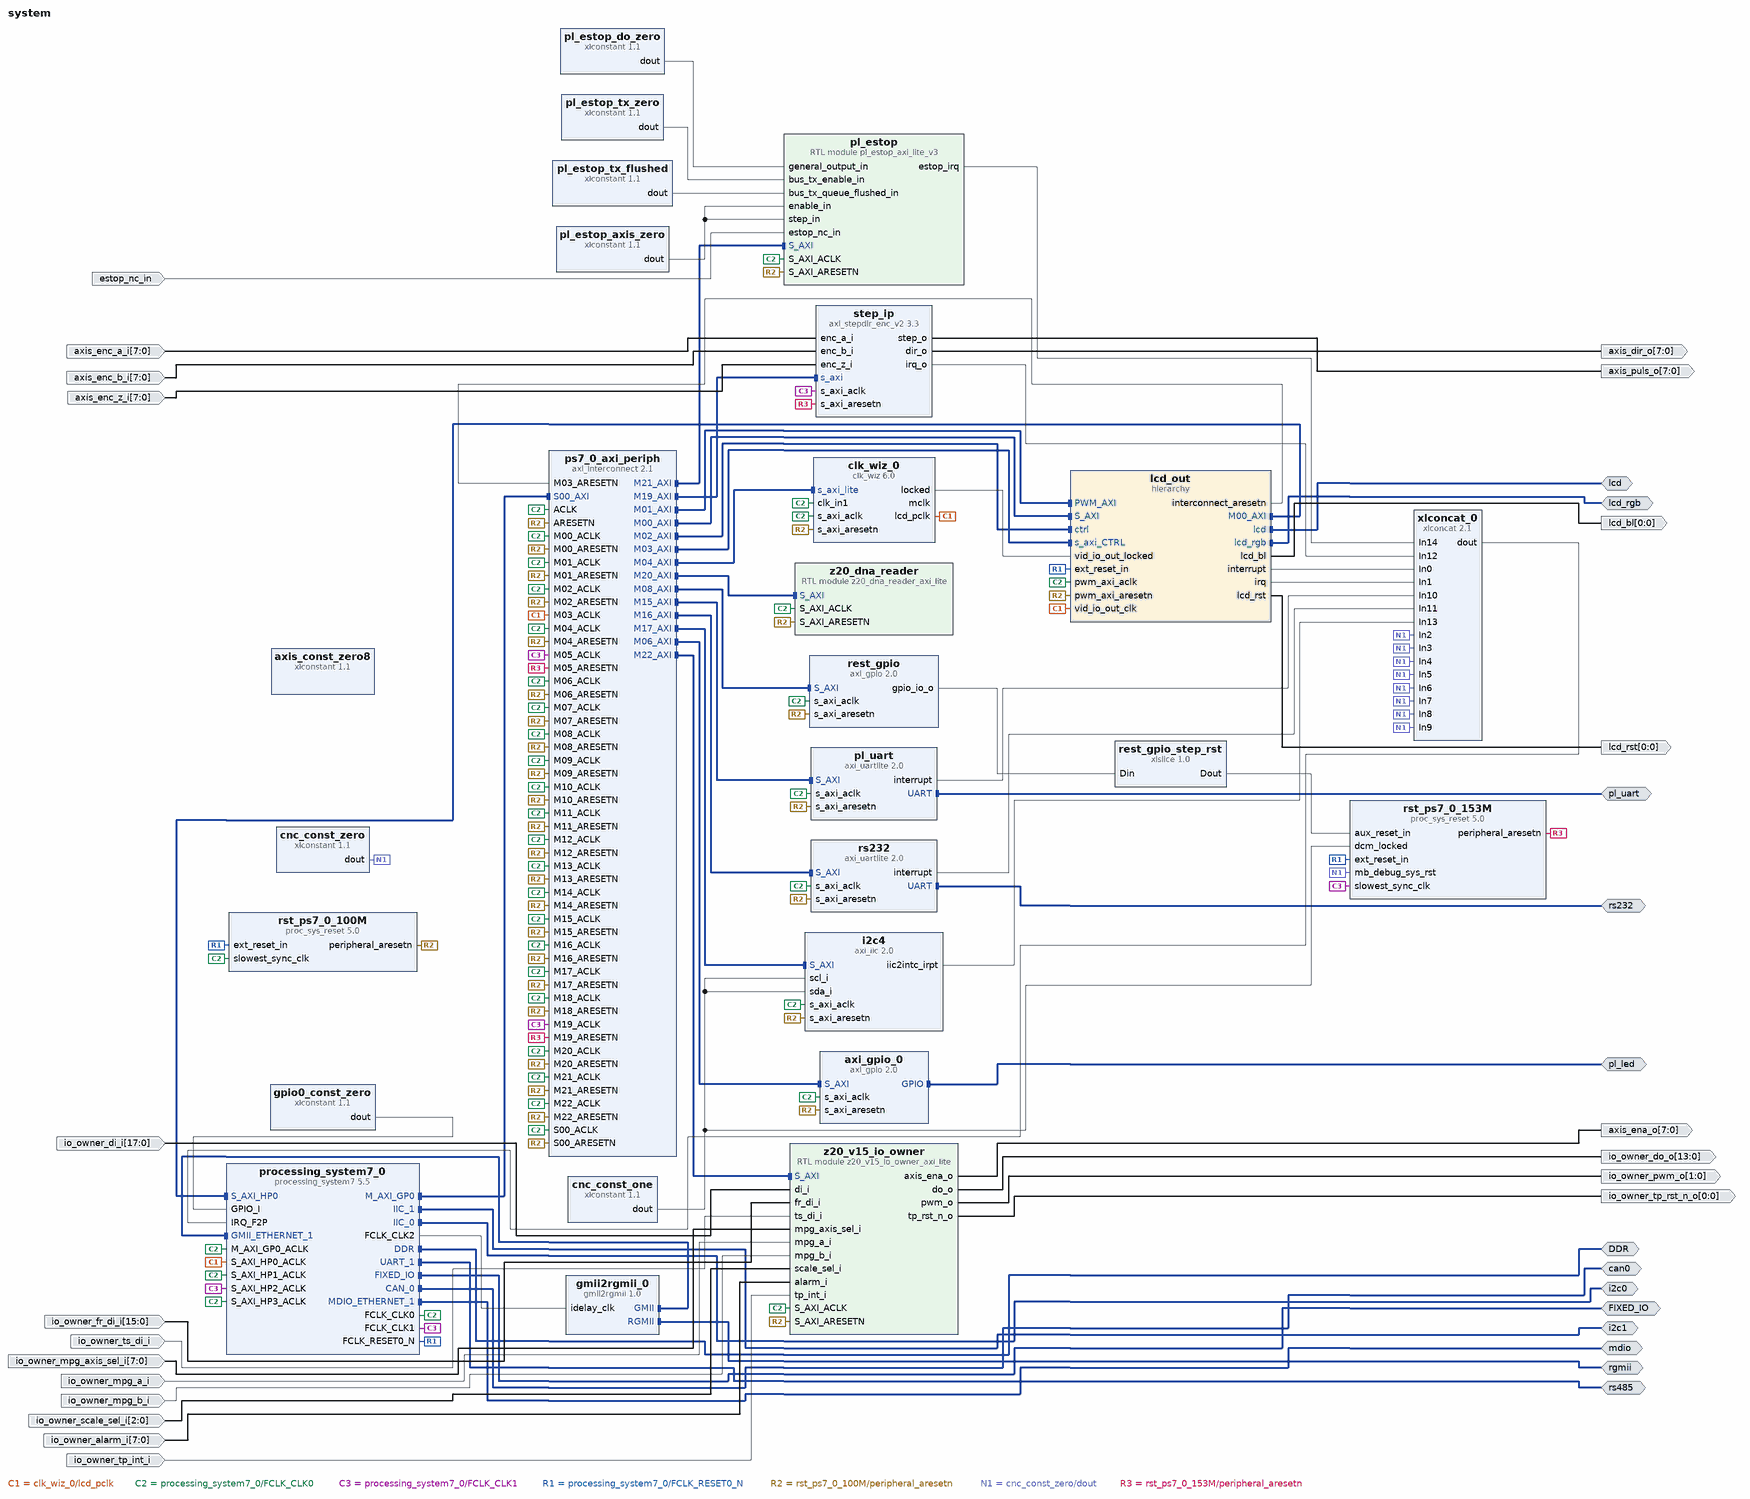
[diagram p0: block diagram of the top level]
# Vivado block design system, xc7z020clg484-2, Vivado 2020.2
create_bd_design system

create_bd_intf_port -mode Master -vlnv xilinx.com:interface:ddrx_rtl:1.0 DDR
create_bd_intf_port -mode Master -vlnv xilinx.com:display_processing_system7:fixedio_rtl:1.0 FIXED_IO
create_bd_intf_port -mode Master -vlnv xilinx.com:interface:can_rtl:1.0 can0
create_bd_intf_port -mode Master -vlnv xilinx.com:interface:iic_rtl:1.0 i2c0
create_bd_intf_port -mode Master -vlnv xilinx.com:interface:iic_rtl:1.0 i2c1
create_bd_intf_port -mode Master -vlnv xilinx.com:user:lcd_rtl:1.0 lcd
create_bd_intf_port -mode Master -vlnv xilinx.com:interface:gpio_rtl:1.0 lcd_rgb
create_bd_intf_port -mode Master -vlnv xilinx.com:interface:mdio_rtl:1.0 mdio
create_bd_intf_port -mode Master -vlnv xilinx.com:interface:gpio_rtl:1.0 pl_led
create_bd_intf_port -mode Master -vlnv xilinx.com:interface:rgmii_rtl:1.0 rgmii
create_bd_intf_port -mode Master -vlnv xilinx.com:interface:uart_rtl:1.0 rs485
create_bd_intf_port -mode Master -vlnv xilinx.com:interface:uart_rtl:1.0 pl_uart
create_bd_intf_port -mode Master -vlnv xilinx.com:interface:uart_rtl:1.0 rs232
create_bd_port -dir O -from 0 -to 0 lcd_bl
create_bd_port -dir O -from 0 -to 0 -type rst lcd_rst
create_bd_port -dir O -from 7 -to 0 axis_puls_o
create_bd_port -dir O -from 7 -to 0 axis_dir_o
create_bd_port -dir O -from 7 -to 0 axis_ena_o
create_bd_port -dir I -from 7 -to 0 axis_enc_a_i
create_bd_port -dir I -from 7 -to 0 axis_enc_b_i
create_bd_port -dir I -from 7 -to 0 axis_enc_z_i
create_bd_port -dir I estop_nc_in
create_bd_port -dir I -from 17 -to 0 io_owner_di_i
create_bd_port -dir I -from 15 -to 0 io_owner_fr_di_i
create_bd_port -dir I io_owner_ts_di_i
create_bd_port -dir I -from 7 -to 0 io_owner_mpg_axis_sel_i
create_bd_port -dir I io_owner_mpg_a_i
create_bd_port -dir I io_owner_mpg_b_i
create_bd_port -dir I -from 2 -to 0 io_owner_scale_sel_i
create_bd_port -dir I -from 7 -to 0 io_owner_alarm_i
create_bd_port -dir I io_owner_tp_int_i
create_bd_port -dir O -from 13 -to 0 io_owner_do_o
create_bd_port -dir O -from 1 -to 0 io_owner_pwm_o
create_bd_port -dir O -from 0 -to 0 io_owner_tp_rst_n_o

create_bd_cell -type hier lcd_out
create_bd_cell -type ip -vlnv xilinx.com:ip:axi_gpio:2.0 axi_gpio_0
set_property -dict {CONFIG.C_ALL_OUTPUTS 1 CONFIG.C_GPIO_WIDTH 2} [get_bd_cells axi_gpio_0]
create_bd_cell -type ip -vlnv xilinx.com:ip:clk_wiz:6.0 clk_wiz_0
set_property -dict [list \
  CONFIG.CLKOUT1_DRIVES BUFG \
  CONFIG.CLKOUT1_JITTER 159.843 \
  CONFIG.CLKOUT1_PHASE_ERROR 94.994 \
  CONFIG.CLKOUT1_REQUESTED_OUT_FREQ 33.33333 \
  CONFIG.CLKOUT2_DRIVES BUFG \
  CONFIG.CLKOUT2_JITTER 183.032 \
  CONFIG.CLKOUT2_PHASE_ERROR 94.994 \
  CONFIG.CLKOUT2_REQUESTED_OUT_FREQ 16.9344 \
  CONFIG.CLKOUT2_USED true \
  CONFIG.CLKOUT3_DRIVES BUFG \
  CONFIG.CLKOUT4_DRIVES BUFG \
  CONFIG.CLKOUT5_DRIVES BUFG \
  CONFIG.CLKOUT6_DRIVES BUFG \
  CONFIG.CLKOUT7_DRIVES BUFG \
  CONFIG.CLK_OUT1_PORT lcd_pclk \
  CONFIG.CLK_OUT2_PORT mclk \
  CONFIG.MMCM_CLKFBOUT_MULT_F 10.500 \
  CONFIG.MMCM_CLKOUT0_DIVIDE_F 31.500 \
  CONFIG.MMCM_CLKOUT1_DIVIDE 62 \
  CONFIG.MMCM_DIVCLK_DIVIDE 1 \
  CONFIG.NUM_OUT_CLKS 2 \
  CONFIG.SECONDARY_SOURCE Single_ended_clock_capable_pin \
  CONFIG.USE_DYN_RECONFIG true \
  CONFIG.USE_PHASE_ALIGNMENT false \
] [get_bd_cells clk_wiz_0]
create_bd_cell -type ip -vlnv xilinx.com:ip:processing_system7:5.5 processing_system7_0
set_property -dict [list \
  CONFIG.PCW_APU_PERIPHERAL_FREQMHZ 767.0 \
  CONFIG.PCW_CAN0_CAN0_IO EMIO \
  CONFIG.PCW_CAN0_PERIPHERAL_ENABLE 1 \
  CONFIG.PCW_CPU_CPU_6X4X_MAX_RANGE 767 \
  CONFIG.PCW_ENET0_ENET0_IO {MIO 16 .. 27} \
  CONFIG.PCW_ENET0_GRP_MDIO_ENABLE 1 \
  CONFIG.PCW_ENET0_GRP_MDIO_IO {MIO 52 .. 53} \
  CONFIG.PCW_ENET0_PERIPHERAL_ENABLE 1 \
  CONFIG.PCW_ENET1_ENET1_IO EMIO \
  CONFIG.PCW_ENET1_GRP_MDIO_ENABLE 1 \
  CONFIG.PCW_ENET1_GRP_MDIO_IO EMIO \
  CONFIG.PCW_ENET1_PERIPHERAL_ENABLE 1 \
  CONFIG.PCW_ENET_RESET_ENABLE 0 \
  CONFIG.PCW_EN_CLK1_PORT 1 \
  CONFIG.PCW_EN_CLK2_PORT 1 \
  CONFIG.PCW_EN_CLK3_PORT 1 \
  CONFIG.PCW_FCLK1_PERIPHERAL_CLKSRC {ARM PLL} \
  CONFIG.PCW_FCLK3_PERIPHERAL_CLKSRC {ARM PLL} \
  CONFIG.PCW_FCLK_CLK1_BUF TRUE \
  CONFIG.PCW_FCLK_CLK2_BUF TRUE \
  CONFIG.PCW_FCLK_CLK3_BUF TRUE \
  CONFIG.PCW_FPGA0_PERIPHERAL_FREQMHZ 100.0 \
  CONFIG.PCW_FPGA1_PERIPHERAL_FREQMHZ 150 \
  CONFIG.PCW_FPGA2_PERIPHERAL_FREQMHZ 200.0 \
  CONFIG.PCW_FPGA3_PERIPHERAL_FREQMHZ 12 \
  CONFIG.PCW_FPGA_FCLK1_ENABLE 1 \
  CONFIG.PCW_FPGA_FCLK2_ENABLE 1 \
  CONFIG.PCW_FPGA_FCLK3_ENABLE 1 \
  CONFIG.PCW_GPIO_EMIO_GPIO_ENABLE 1 \
  CONFIG.PCW_GPIO_EMIO_GPIO_IO 7 \
  CONFIG.PCW_GPIO_EMIO_GPIO_WIDTH 7 \
  CONFIG.PCW_GPIO_MIO_GPIO_ENABLE 1 \
  CONFIG.PCW_GPIO_MIO_GPIO_IO MIO \
  CONFIG.PCW_I2C0_I2C0_IO EMIO \
  CONFIG.PCW_I2C0_PERIPHERAL_ENABLE 1 \
  CONFIG.PCW_I2C1_I2C1_IO EMIO \
  CONFIG.PCW_I2C1_PERIPHERAL_ENABLE 1 \
  CONFIG.PCW_I2C_PERIPHERAL_FREQMHZ 127.777779 \
  CONFIG.PCW_I2C_RESET_ENABLE 0 \
  CONFIG.PCW_IRQ_F2P_INTR 1 \
  CONFIG.PCW_PERIPHERAL_BOARD_PRESET None \
  CONFIG.PCW_PRESET_BANK1_VOLTAGE {LVCMOS 1.8V} \
  CONFIG.PCW_QSPI_GRP_SINGLE_SS_ENABLE 1 \
  CONFIG.PCW_QSPI_GRP_SINGLE_SS_IO {MIO 1 .. 6} \
  CONFIG.PCW_QSPI_PERIPHERAL_ENABLE 1 \
  CONFIG.PCW_QSPI_QSPI_IO {MIO 1 .. 6} \
  CONFIG.PCW_SD0_GRP_CD_ENABLE 1 \
  CONFIG.PCW_SD0_GRP_CD_IO {MIO 10} \
  CONFIG.PCW_SD0_GRP_WP_ENABLE 0 \
  CONFIG.PCW_SD0_PERIPHERAL_ENABLE 1 \
  CONFIG.PCW_SD0_SD0_IO {MIO 40 .. 45} \
  CONFIG.PCW_SD1_PERIPHERAL_ENABLE 1 \
  CONFIG.PCW_SD1_SD1_IO {MIO 46 .. 51} \
  CONFIG.PCW_SDIO_PERIPHERAL_FREQMHZ 100 \
  CONFIG.PCW_SINGLE_QSPI_DATA_MODE x4 \
  CONFIG.PCW_UART0_PERIPHERAL_ENABLE 1 \
  CONFIG.PCW_UART0_UART0_IO {MIO 14 .. 15} \
  CONFIG.PCW_UART1_PERIPHERAL_ENABLE 1 \
  CONFIG.PCW_UART1_UART1_IO EMIO \
  CONFIG.PCW_UART_PERIPHERAL_FREQMHZ 100 \
  CONFIG.PCW_UIPARAM_DDR_FREQ_MHZ 533.333333 \
  CONFIG.PCW_UIPARAM_DDR_MEMORY_TYPE {DDR 3 (Low Voltage)} \
  CONFIG.PCW_UIPARAM_DDR_PARTNO {MT41K256M16 RE-125} \
  CONFIG.PCW_USB0_PERIPHERAL_ENABLE 1 \
  CONFIG.PCW_USB0_RESET_ENABLE 1 \
  CONFIG.PCW_USB0_RESET_IO {MIO 9} \
  CONFIG.PCW_USB0_USB0_IO {MIO 28 .. 39} \
  CONFIG.PCW_USB_RESET_ENABLE 1 \
  CONFIG.PCW_USB_RESET_SELECT {Share reset pin} \
  CONFIG.PCW_USE_FABRIC_INTERRUPT 1 \
  CONFIG.PCW_USE_S_AXI_HP0 1 \
  CONFIG.PCW_USE_S_AXI_HP1 1 \
  CONFIG.PCW_USE_S_AXI_HP2 1 \
  CONFIG.PCW_USE_S_AXI_HP3 1 \
  CONFIG.preset None \
] [get_bd_cells processing_system7_0]
# 523 more settings of processing_system7_0 are not shown: defaults, MIO pin electricals, DDR timing, and values the tool derives
create_bd_cell -type ip -vlnv xilinx.com:ip:axi_interconnect:2.1 ps7_0_axi_periph
set_property -dict {CONFIG.NUM_MI 23} [get_bd_cells ps7_0_axi_periph]
create_bd_cell -type ip -vlnv xilinx.com:ip:axi_gpio:2.0 rest_gpio
set_property -dict {CONFIG.C_ALL_OUTPUTS 1 CONFIG.C_GPIO_WIDTH 3} [get_bd_cells rest_gpio]
create_bd_cell -type ip -vlnv xilinx.com:ip:proc_sys_reset:5.0 rst_ps7_0_100M
create_bd_cell -type ip -vlnv xilinx.com:ip:xlconcat:2.1 xlconcat_0
set_property -dict {CONFIG.NUM_PORTS 15 CONFIG.dout_width 15} [get_bd_cells xlconcat_0]
create_bd_cell -type ip -vlnv xilinx.com:ip:axi_uartlite:2.0 pl_uart
set_property -dict {CONFIG.C_BAUDRATE 115200} [get_bd_cells pl_uart]
create_bd_cell -type ip -vlnv xilinx.com:ip:axi_uartlite:2.0 rs232
set_property -dict {CONFIG.C_BAUDRATE 9600} [get_bd_cells rs232]
create_bd_cell -type ip -vlnv xilinx.com:ip:axi_iic:2.0 i2c4
create_bd_cell -type ip -vlnv xilinx.com:ip:proc_sys_reset:5.0 rst_ps7_0_153M
create_bd_cell -type ip -vlnv xilinx.com:ip:xlconstant:1.1 cnc_const_zero
set_property -dict {CONFIG.CONST_VAL 0 CONFIG.CONST_WIDTH 1} [get_bd_cells cnc_const_zero]
create_bd_cell -type ip -vlnv xilinx.com:ip:xlconstant:1.1 cnc_const_one
set_property -dict {CONFIG.CONST_VAL 1 CONFIG.CONST_WIDTH 1} [get_bd_cells cnc_const_one]
create_bd_cell -type ip -vlnv xilinx.com:ip:xlslice:1.0 rest_gpio_step_rst
set_property -dict {CONFIG.DIN_FROM 1 CONFIG.DIN_TO 1 CONFIG.DIN_WIDTH 3} [get_bd_cells rest_gpio_step_rst]
create_bd_cell -type ip -vlnv atk:user:axi_stepdir_enc_v2:3.3 step_ip
set_property -dict {CONFIG.CLK_FREQ_HZ 153333344 CONFIG.N_AXES 8} [get_bd_cells step_ip]
create_bd_cell -type ip -vlnv xilinx.com:user:gmii2rgmii:1.0 gmii2rgmii_0
set_property -dict {CONFIG.IDELAY_VALUE 31 CONFIG.TX_CLK_FROM_RX 1} [get_bd_cells gmii2rgmii_0]
create_bd_cell -type module -reference z20_dna_reader_axi_lite z20_dna_reader
create_bd_cell -type ip -vlnv xilinx.com:ip:xlconstant:1.1 pl_estop_axis_zero
set_property -dict {CONFIG.CONST_VAL 0 CONFIG.CONST_WIDTH 8} [get_bd_cells pl_estop_axis_zero]
create_bd_cell -type ip -vlnv xilinx.com:ip:xlconstant:1.1 gpio0_const_zero
set_property -dict {CONFIG.CONST_VAL 0 CONFIG.CONST_WIDTH 7} [get_bd_cells gpio0_const_zero]
create_bd_cell -type ip -vlnv xilinx.com:ip:xlconstant:1.1 pl_estop_do_zero
set_property -dict {CONFIG.CONST_VAL 0 CONFIG.CONST_WIDTH 16} [get_bd_cells pl_estop_do_zero]
create_bd_cell -type ip -vlnv xilinx.com:ip:xlconstant:1.1 pl_estop_tx_zero
set_property -dict {CONFIG.CONST_VAL 0 CONFIG.CONST_WIDTH 1} [get_bd_cells pl_estop_tx_zero]
create_bd_cell -type ip -vlnv xilinx.com:ip:xlconstant:1.1 pl_estop_tx_flushed
set_property -dict {CONFIG.CONST_VAL 1 CONFIG.CONST_WIDTH 1} [get_bd_cells pl_estop_tx_flushed]
create_bd_cell -type ip -vlnv xilinx.com:ip:xlconstant:1.1 axis_const_zero8
set_property -dict {CONFIG.CONST_VAL 0 CONFIG.CONST_WIDTH 8} [get_bd_cells axis_const_zero8]
create_bd_cell -type module -reference pl_estop_axi_lite_v3 pl_estop
create_bd_cell -type module -reference z20_v15_io_owner_axi_lite z20_v15_io_owner

# ---- hierarchy /lcd_out ----
current_bd_instance /lcd_out
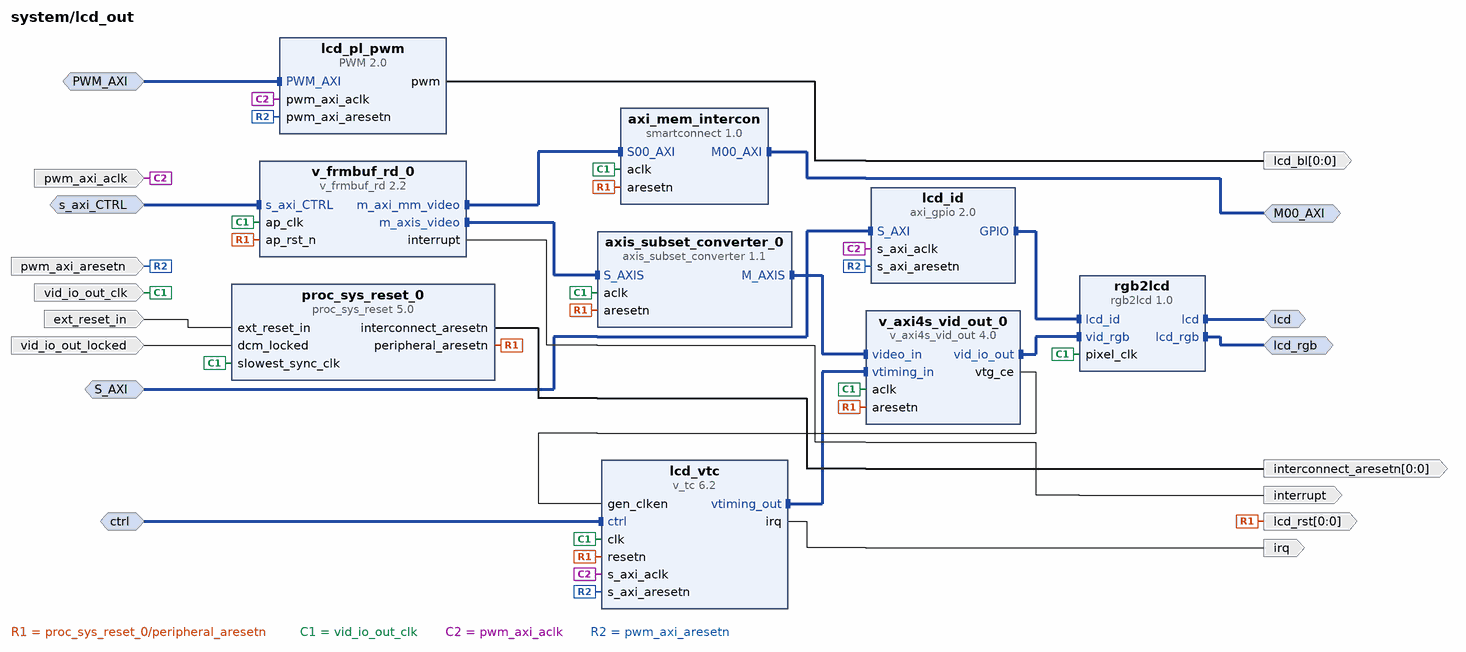
[diagram p1: block diagram inside /lcd_out]
create_bd_intf_pin -mode Master -vlnv xilinx.com:interface:aximm_rtl:1.0 M00_AXI
create_bd_intf_pin -mode Slave -vlnv xilinx.com:interface:aximm_rtl:1.0 PWM_AXI
create_bd_intf_pin -mode Slave -vlnv xilinx.com:interface:aximm_rtl:1.0 S_AXI
create_bd_intf_pin -mode Slave -vlnv xilinx.com:interface:aximm_rtl:1.0 ctrl
create_bd_intf_pin -mode Master -vlnv xilinx.com:user:lcd_rtl:1.0 lcd
create_bd_intf_pin -mode Master -vlnv xilinx.com:interface:gpio_rtl:1.0 lcd_rgb
create_bd_intf_pin -mode Slave -vlnv xilinx.com:interface:aximm_rtl:1.0 s_axi_CTRL
create_bd_pin -dir I -type rst ext_reset_in
create_bd_pin -dir O -from 0 -to 0 -type rst interconnect_aresetn
create_bd_pin -dir O -type intr interrupt
create_bd_pin -dir O -type intr irq
create_bd_pin -dir O -from 0 -to 0 lcd_bl
create_bd_pin -dir O -from 0 -to 0 -type rst lcd_rst
create_bd_pin -dir I -type clk pwm_axi_aclk
create_bd_pin -dir I -type rst pwm_axi_aresetn
create_bd_pin -dir I -type clk vid_io_out_clk
create_bd_pin -dir I vid_io_out_locked

create_bd_cell -type ip -vlnv xilinx.com:ip:axis_subset_converter:1.1 axis_subset_converter_0
set_property -dict [list \
  CONFIG.M_TDATA_NUM_BYTES 3 \
  CONFIG.S_TDATA_NUM_BYTES 3 \
  CONFIG.TDATA_REMAP {tdata[15:8],tdata[7:0],tdata[23:16]} \
  CONFIG.TDEST_REMAP {tdest[0:0]} \
  CONFIG.TID_REMAP {tid[0:0]} \
  CONFIG.TKEEP_REMAP {tkeep[2:0]} \
  CONFIG.TLAST_REMAP {tlast[0]} \
  CONFIG.TSTRB_REMAP {tstrb[2:0]} \
  CONFIG.TUSER_REMAP {tuser[0:0]} \
] [get_bd_cells axis_subset_converter_0]
create_bd_cell -type ip -vlnv xilinx.com:ip:axi_gpio:2.0 lcd_id
set_property -dict {CONFIG.C_GPIO_WIDTH 3} [get_bd_cells lcd_id]
create_bd_cell -type ip -vlnv digilentinc.com:IP:PWM:2.0 lcd_pl_pwm
create_bd_cell -type ip -vlnv xilinx.com:ip:v_tc:6.2 lcd_vtc
set_property -dict [list \
  CONFIG.enable_detection false \
  CONFIG.max_clocks_per_line 2048 \
  CONFIG.max_lines_per_frame 2048 \
] [get_bd_cells lcd_vtc]
create_bd_cell -type ip -vlnv xilinx.com:ip:proc_sys_reset:5.0 proc_sys_reset_0
create_bd_cell -type ip -vlnv www.alientek.com:user:rgb2lcd:1.0 rgb2lcd
create_bd_cell -type ip -vlnv xilinx.com:ip:v_axi4s_vid_out:4.0 v_axi4s_vid_out_0
set_property -dict {CONFIG.C_ADDR_WIDTH 10 CONFIG.C_HAS_ASYNC_CLK 0} [get_bd_cells v_axi4s_vid_out_0]
create_bd_cell -type ip -vlnv xilinx.com:ip:v_frmbuf_rd:2.2 v_frmbuf_rd_0
set_property -dict [list \
  CONFIG.AXIMM_BURST_LENGTH 2 \
  CONFIG.AXIMM_DATA_WIDTH 64 \
  CONFIG.AXIMM_NUM_OUTSTANDING 2 \
  CONFIG.C_M_AXI_MM_VIDEO_DATA_WIDTH 64 \
  CONFIG.HAS_BGR8 1 \
  CONFIG.MAX_COLS 1920 \
  CONFIG.MAX_ROWS 1080 \
  CONFIG.SAMPLES_PER_CLOCK 1 \
] [get_bd_cells v_frmbuf_rd_0]
create_bd_cell -type ip -vlnv xilinx.com:ip:smartconnect:1.0 axi_mem_intercon
set_property -dict {CONFIG.NUM_MI 1 CONFIG.NUM_SI 1} [get_bd_cells axi_mem_intercon]

# ---- connections ----

current_bd_instance /lcd_out
connect_bd_intf_net [get_bd_intf_pins rgb2lcd/vid_rgb] [get_bd_intf_pins v_axi4s_vid_out_0/vid_io_out]
connect_bd_intf_net [get_bd_intf_pins M00_AXI] [get_bd_intf_pins axi_mem_intercon/M00_AXI]
connect_bd_intf_net [get_bd_intf_pins S_AXI] [get_bd_intf_pins lcd_id/S_AXI]
connect_bd_intf_net [get_bd_intf_pins axis_subset_converter_0/M_AXIS] [get_bd_intf_pins v_axi4s_vid_out_0/video_in]
connect_bd_intf_net [get_bd_intf_pins v_frmbuf_rd_0/m_axis_video] [get_bd_intf_pins axis_subset_converter_0/S_AXIS]
connect_bd_intf_net [get_bd_intf_pins ctrl] [get_bd_intf_pins lcd_vtc/ctrl]
connect_bd_intf_net [get_bd_intf_pins axi_mem_intercon/S00_AXI] [get_bd_intf_pins v_frmbuf_rd_0/m_axi_mm_video]
connect_bd_intf_net [get_bd_intf_pins lcd_vtc/vtiming_out] [get_bd_intf_pins v_axi4s_vid_out_0/vtiming_in]
connect_bd_intf_net [get_bd_intf_pins s_axi_CTRL] [get_bd_intf_pins v_frmbuf_rd_0/s_axi_CTRL]
connect_bd_intf_net -intf_net rgb2lcd_1_lcd_rgb [get_bd_intf_pins lcd_rgb] [get_bd_intf_pins rgb2lcd/lcd_rgb]
connect_bd_intf_net [get_bd_intf_pins PWM_AXI] [get_bd_intf_pins lcd_pl_pwm/PWM_AXI]
connect_bd_intf_net -intf_net gpio1_GPIO [get_bd_intf_pins lcd_id/GPIO] [get_bd_intf_pins rgb2lcd/lcd_id]
connect_bd_intf_net -intf_net rgb2lcd_1_lcd [get_bd_intf_pins lcd] [get_bd_intf_pins rgb2lcd/lcd]
connect_bd_net -net ap_rst_n_1 [get_bd_pins proc_sys_reset_0/peripheral_aresetn] \
  [get_bd_pins lcd_rst] [get_bd_pins lcd_vtc/resetn] [get_bd_pins axis_subset_converter_0/aresetn] \
  [get_bd_pins v_axi4s_vid_out_0/aresetn] [get_bd_pins v_frmbuf_rd_0/ap_rst_n] [get_bd_pins axi_mem_intercon/aresetn]
connect_bd_net -net clk_wiz_0_clk_out1 [get_bd_pins vid_io_out_clk] \
  [get_bd_pins axis_subset_converter_0/aclk] [get_bd_pins lcd_vtc/clk] [get_bd_pins proc_sys_reset_0/slowest_sync_clk] \
  [get_bd_pins rgb2lcd/pixel_clk] [get_bd_pins v_axi4s_vid_out_0/aclk] [get_bd_pins v_frmbuf_rd_0/ap_clk] \
  [get_bd_pins axi_mem_intercon/aclk]
connect_bd_net [get_bd_pins ext_reset_in] [get_bd_pins proc_sys_reset_0/ext_reset_in]
connect_bd_net [get_bd_pins lcd_vtc/irq] [get_bd_pins irq]
connect_bd_net [get_bd_pins proc_sys_reset_0/interconnect_aresetn] [get_bd_pins interconnect_aresetn]
connect_bd_net -net processing_system7_0_FCLK_CLK0 [get_bd_pins pwm_axi_aclk] \
  [get_bd_pins lcd_id/s_axi_aclk] [get_bd_pins lcd_pl_pwm/pwm_axi_aclk] [get_bd_pins lcd_vtc/s_axi_aclk]
connect_bd_net -net pwm_0_pwm [get_bd_pins lcd_pl_pwm/pwm] [get_bd_pins lcd_bl]
connect_bd_net -net rst_ps7_0_100M_peripheral_aresetn [get_bd_pins pwm_axi_aresetn] \
  [get_bd_pins lcd_id/s_axi_aresetn] [get_bd_pins lcd_pl_pwm/pwm_axi_aresetn] [get_bd_pins lcd_vtc/s_axi_aresetn]
connect_bd_net [get_bd_pins v_axi4s_vid_out_0/vtg_ce] [get_bd_pins lcd_vtc/gen_clken]
connect_bd_net [get_bd_pins v_frmbuf_rd_0/interrupt] [get_bd_pins interrupt]
connect_bd_net -net lcd_vid_lock [get_bd_pins vid_io_out_locked] [get_bd_pins proc_sys_reset_0/dcm_locked]

current_bd_instance /
connect_bd_intf_net [get_bd_intf_ports pl_uart] [get_bd_intf_pins pl_uart/UART]
connect_bd_intf_net [get_bd_intf_pins ps7_0_axi_periph/M22_AXI] [get_bd_intf_pins z20_v15_io_owner/S_AXI]
connect_bd_intf_net [get_bd_intf_pins ps7_0_axi_periph/M20_AXI] [get_bd_intf_pins z20_dna_reader/S_AXI]
connect_bd_intf_net [get_bd_intf_ports i2c1] [get_bd_intf_pins processing_system7_0/IIC_1]
connect_bd_intf_net [get_bd_intf_ports i2c0] [get_bd_intf_pins processing_system7_0/IIC_0]
connect_bd_intf_net [get_bd_intf_ports pl_led] [get_bd_intf_pins axi_gpio_0/GPIO]
connect_bd_intf_net [get_bd_intf_pins lcd_out/PWM_AXI] [get_bd_intf_pins ps7_0_axi_periph/M01_AXI]
connect_bd_intf_net [get_bd_intf_ports DDR] [get_bd_intf_pins processing_system7_0/DDR]
connect_bd_intf_net [get_bd_intf_ports rs485] [get_bd_intf_pins processing_system7_0/UART_1]
connect_bd_intf_net -intf_net rgb2lcd_1_lcd [get_bd_intf_ports lcd] [get_bd_intf_pins lcd_out/lcd]
connect_bd_intf_net [get_bd_intf_ports FIXED_IO] [get_bd_intf_pins processing_system7_0/FIXED_IO]
connect_bd_intf_net [get_bd_intf_ports can0] [get_bd_intf_pins processing_system7_0/CAN_0]
connect_bd_intf_net [get_bd_intf_pins lcd_out/M00_AXI] [get_bd_intf_pins processing_system7_0/S_AXI_HP0]
connect_bd_intf_net [get_bd_intf_pins lcd_out/S_AXI] [get_bd_intf_pins ps7_0_axi_periph/M00_AXI]
connect_bd_intf_net [get_bd_intf_pins ps7_0_axi_periph/M08_AXI] [get_bd_intf_pins rest_gpio/S_AXI]
connect_bd_intf_net [get_bd_intf_pins processing_system7_0/M_AXI_GP0] [get_bd_intf_pins ps7_0_axi_periph/S00_AXI]
connect_bd_intf_net [get_bd_intf_pins axi_gpio_0/S_AXI] [get_bd_intf_pins ps7_0_axi_periph/M06_AXI]
connect_bd_intf_net [get_bd_intf_ports rgmii] [get_bd_intf_pins gmii2rgmii_0/RGMII]
connect_bd_intf_net [get_bd_intf_pins clk_wiz_0/s_axi_lite] [get_bd_intf_pins ps7_0_axi_periph/M04_AXI]
connect_bd_intf_net [get_bd_intf_pins lcd_out/ctrl] [get_bd_intf_pins ps7_0_axi_periph/M02_AXI]
connect_bd_intf_net [get_bd_intf_pins ps7_0_axi_periph/M21_AXI] [get_bd_intf_pins pl_estop/S_AXI]
connect_bd_intf_net [get_bd_intf_pins ps7_0_axi_periph/M16_AXI] [get_bd_intf_pins rs232/S_AXI]
connect_bd_intf_net -intf_net rgb2lcd_1_lcd_rgb [get_bd_intf_ports lcd_rgb] [get_bd_intf_pins lcd_out/lcd_rgb]
connect_bd_intf_net [get_bd_intf_pins gmii2rgmii_0/GMII] [get_bd_intf_pins processing_system7_0/GMII_ETHERNET_1]
connect_bd_intf_net [get_bd_intf_pins ps7_0_axi_periph/M19_AXI] [get_bd_intf_pins step_ip/s_axi]
connect_bd_intf_net [get_bd_intf_pins lcd_out/s_axi_CTRL] [get_bd_intf_pins ps7_0_axi_periph/M03_AXI]
connect_bd_intf_net [get_bd_intf_pins ps7_0_axi_periph/M15_AXI] [get_bd_intf_pins pl_uart/S_AXI]
connect_bd_intf_net [get_bd_intf_ports rs232] [get_bd_intf_pins rs232/UART]
connect_bd_intf_net [get_bd_intf_pins ps7_0_axi_periph/M17_AXI] [get_bd_intf_pins i2c4/S_AXI]
connect_bd_intf_net [get_bd_intf_ports mdio] [get_bd_intf_pins processing_system7_0/MDIO_ETHERNET_1]
connect_bd_net -net M03_ARESETN_1 [get_bd_pins lcd_out/interconnect_aresetn] [get_bd_pins ps7_0_axi_periph/M03_ARESETN]
connect_bd_net -net clk_wiz_0_clk_out1 [get_bd_pins clk_wiz_0/lcd_pclk] \
  [get_bd_pins lcd_out/vid_io_out_clk] [get_bd_pins processing_system7_0/S_AXI_HP0_ACLK] \
  [get_bd_pins ps7_0_axi_periph/M03_ACLK]
connect_bd_net [get_bd_pins clk_wiz_0/locked] [get_bd_pins lcd_out/vid_io_out_locked]
# net clk_wiz_0_mclk has one end: clk_wiz_0/mclk
connect_bd_net [get_bd_pins lcd_out/interrupt] [get_bd_pins xlconcat_0/In0]
connect_bd_net [get_bd_pins lcd_out/irq] [get_bd_pins xlconcat_0/In1]
connect_bd_net [get_bd_pins lcd_out/lcd_rst] [get_bd_ports lcd_rst]
connect_bd_net [get_bd_pins processing_system7_0/FCLK_CLK0] \
  [get_bd_pins lcd_out/pwm_axi_aclk] [get_bd_pins axi_gpio_0/s_axi_aclk] [get_bd_pins clk_wiz_0/s_axi_aclk] \
  [get_bd_pins clk_wiz_0/clk_in1] [get_bd_pins processing_system7_0/M_AXI_GP0_ACLK] \
  [get_bd_pins processing_system7_0/S_AXI_HP3_ACLK] [get_bd_pins ps7_0_axi_periph/ACLK] \
  [get_bd_pins ps7_0_axi_periph/S00_ACLK] [get_bd_pins ps7_0_axi_periph/M00_ACLK] [get_bd_pins ps7_0_axi_periph/M01_ACLK] \
  [get_bd_pins ps7_0_axi_periph/M02_ACLK] [get_bd_pins ps7_0_axi_periph/M04_ACLK] [get_bd_pins ps7_0_axi_periph/M06_ACLK] \
  [get_bd_pins ps7_0_axi_periph/M07_ACLK] [get_bd_pins ps7_0_axi_periph/M08_ACLK] [get_bd_pins ps7_0_axi_periph/M09_ACLK] \
  [get_bd_pins ps7_0_axi_periph/M10_ACLK] [get_bd_pins ps7_0_axi_periph/M11_ACLK] [get_bd_pins ps7_0_axi_periph/M12_ACLK] \
  [get_bd_pins ps7_0_axi_periph/M13_ACLK] [get_bd_pins rest_gpio/s_axi_aclk] [get_bd_pins rst_ps7_0_100M/slowest_sync_clk] \
  [get_bd_pins pl_uart/s_axi_aclk] [get_bd_pins ps7_0_axi_periph/M15_ACLK] [get_bd_pins rs232/s_axi_aclk] \
  [get_bd_pins ps7_0_axi_periph/M16_ACLK] [get_bd_pins ps7_0_axi_periph/M17_ACLK] [get_bd_pins i2c4/s_axi_aclk] \
  [get_bd_pins ps7_0_axi_periph/M18_ACLK] [get_bd_pins z20_dna_reader/S_AXI_ACLK] [get_bd_pins ps7_0_axi_periph/M20_ACLK] \
  [get_bd_pins ps7_0_axi_periph/M21_ACLK] [get_bd_pins ps7_0_axi_periph/M14_ACLK] \
  [get_bd_pins processing_system7_0/S_AXI_HP1_ACLK] [get_bd_pins pl_estop/S_AXI_ACLK] \
  [get_bd_pins z20_v15_io_owner/S_AXI_ACLK] [get_bd_pins ps7_0_axi_periph/M22_ACLK]
connect_bd_net [get_bd_pins processing_system7_0/FCLK_CLK1] \
  [get_bd_pins processing_system7_0/S_AXI_HP2_ACLK] [get_bd_pins ps7_0_axi_periph/M05_ACLK] \
  [get_bd_pins ps7_0_axi_periph/M19_ACLK] [get_bd_pins rst_ps7_0_153M/slowest_sync_clk] [get_bd_pins step_ip/s_axi_aclk]
connect_bd_net [get_bd_pins processing_system7_0/FCLK_CLK2] [get_bd_pins gmii2rgmii_0/idelay_clk]
connect_bd_net [get_bd_pins processing_system7_0/FCLK_RESET0_N] \
  [get_bd_pins lcd_out/ext_reset_in] [get_bd_pins rst_ps7_0_100M/ext_reset_in] [get_bd_pins rst_ps7_0_153M/ext_reset_in]
connect_bd_net -net pwm_0_pwm [get_bd_pins lcd_out/lcd_bl] [get_bd_ports lcd_bl]
connect_bd_net [get_bd_pins rest_gpio/gpio_io_o] [get_bd_pins rest_gpio_step_rst/Din]
connect_bd_net [get_bd_pins rst_ps7_0_100M/peripheral_aresetn] \
  [get_bd_pins lcd_out/pwm_axi_aresetn] [get_bd_pins axi_gpio_0/s_axi_aresetn] [get_bd_pins clk_wiz_0/s_axi_aresetn] \
  [get_bd_pins ps7_0_axi_periph/ARESETN] [get_bd_pins ps7_0_axi_periph/S00_ARESETN] \
  [get_bd_pins ps7_0_axi_periph/M00_ARESETN] [get_bd_pins ps7_0_axi_periph/M01_ARESETN] \
  [get_bd_pins ps7_0_axi_periph/M02_ARESETN] [get_bd_pins ps7_0_axi_periph/M04_ARESETN] \
  [get_bd_pins ps7_0_axi_periph/M06_ARESETN] [get_bd_pins ps7_0_axi_periph/M07_ARESETN] \
  [get_bd_pins ps7_0_axi_periph/M08_ARESETN] [get_bd_pins ps7_0_axi_periph/M09_ARESETN] \
  [get_bd_pins ps7_0_axi_periph/M10_ARESETN] [get_bd_pins ps7_0_axi_periph/M11_ARESETN] \
  [get_bd_pins ps7_0_axi_periph/M12_ARESETN] [get_bd_pins ps7_0_axi_periph/M13_ARESETN] [get_bd_pins rest_gpio/s_axi_aresetn] \
  [get_bd_pins pl_uart/s_axi_aresetn] [get_bd_pins ps7_0_axi_periph/M15_ARESETN] [get_bd_pins rs232/s_axi_aresetn] \
  [get_bd_pins ps7_0_axi_periph/M16_ARESETN] [get_bd_pins ps7_0_axi_periph/M17_ARESETN] [get_bd_pins i2c4/s_axi_aresetn] \
  [get_bd_pins ps7_0_axi_periph/M18_ARESETN] [get_bd_pins z20_dna_reader/S_AXI_ARESETN] \
  [get_bd_pins ps7_0_axi_periph/M20_ARESETN] [get_bd_pins ps7_0_axi_periph/M21_ARESETN] \
  [get_bd_pins ps7_0_axi_periph/M14_ARESETN] [get_bd_pins pl_estop/S_AXI_ARESETN] \
  [get_bd_pins z20_v15_io_owner/S_AXI_ARESETN] [get_bd_pins ps7_0_axi_periph/M22_ARESETN]
connect_bd_net [get_bd_pins xlconcat_0/dout] [get_bd_pins processing_system7_0/IRQ_F2P]
connect_bd_net [get_bd_pins pl_uart/interrupt] [get_bd_pins xlconcat_0/In10]
connect_bd_net [get_bd_pins rs232/interrupt] [get_bd_pins xlconcat_0/In11]
connect_bd_net [get_bd_pins i2c4/iic2intc_irpt] [get_bd_pins xlconcat_0/In13]
connect_bd_net [get_bd_pins step_ip/irq_o] [get_bd_pins xlconcat_0/In12]
connect_bd_net [get_bd_pins cnc_const_one/dout] [get_bd_pins rst_ps7_0_153M/dcm_locked] [get_bd_pins i2c4/scl_i] [get_bd_pins i2c4/sda_i]
connect_bd_net [get_bd_pins cnc_const_zero/dout] \
  [get_bd_pins rst_ps7_0_153M/mb_debug_sys_rst] [get_bd_pins xlconcat_0/In2] [get_bd_pins xlconcat_0/In3] \
  [get_bd_pins xlconcat_0/In4] [get_bd_pins xlconcat_0/In5] [get_bd_pins xlconcat_0/In6] [get_bd_pins xlconcat_0/In7] \
  [get_bd_pins xlconcat_0/In8] [get_bd_pins xlconcat_0/In9]
connect_bd_net [get_bd_pins rst_ps7_0_153M/peripheral_aresetn] \
  [get_bd_pins ps7_0_axi_periph/M05_ARESETN] [get_bd_pins ps7_0_axi_periph/M19_ARESETN] [get_bd_pins step_ip/s_axi_aresetn]
connect_bd_net [get_bd_pins rest_gpio_step_rst/Dout] [get_bd_pins rst_ps7_0_153M/aux_reset_in]
connect_bd_net [get_bd_pins gpio0_const_zero/dout] [get_bd_pins processing_system7_0/GPIO_I]
connect_bd_net -net pl_estop_general_output_zero_dout [get_bd_pins pl_estop_do_zero/dout] [get_bd_pins pl_estop/general_output_in]
connect_bd_net [get_bd_pins pl_estop_tx_zero/dout] [get_bd_pins pl_estop/bus_tx_enable_in]
connect_bd_net [get_bd_pins pl_estop_tx_flushed/dout] [get_bd_pins pl_estop/bus_tx_queue_flushed_in]
connect_bd_net [get_bd_pins pl_estop/estop_irq] [get_bd_pins xlconcat_0/In14]
connect_bd_net [get_bd_pins step_ip/step_o] [get_bd_ports axis_puls_o]
connect_bd_net [get_bd_pins step_ip/dir_o] [get_bd_ports axis_dir_o]
connect_bd_net [get_bd_ports axis_enc_a_i] [get_bd_pins step_ip/enc_a_i]
connect_bd_net [get_bd_ports axis_enc_b_i] [get_bd_pins step_ip/enc_b_i]
connect_bd_net [get_bd_ports axis_enc_z_i] [get_bd_pins step_ip/enc_z_i]
connect_bd_net [get_bd_pins pl_estop_axis_zero/dout] [get_bd_pins pl_estop/step_in] [get_bd_pins pl_estop/enable_in]
connect_bd_net [get_bd_ports estop_nc_in] [get_bd_pins pl_estop/estop_nc_in]
connect_bd_net [get_bd_ports io_owner_di_i] [get_bd_pins z20_v15_io_owner/di_i]
connect_bd_net [get_bd_ports io_owner_fr_di_i] [get_bd_pins z20_v15_io_owner/fr_di_i]
connect_bd_net [get_bd_ports io_owner_ts_di_i] [get_bd_pins z20_v15_io_owner/ts_di_i]
connect_bd_net [get_bd_ports io_owner_mpg_axis_sel_i] [get_bd_pins z20_v15_io_owner/mpg_axis_sel_i]
connect_bd_net [get_bd_ports io_owner_mpg_a_i] [get_bd_pins z20_v15_io_owner/mpg_a_i]
connect_bd_net [get_bd_ports io_owner_mpg_b_i] [get_bd_pins z20_v15_io_owner/mpg_b_i]
connect_bd_net [get_bd_ports io_owner_scale_sel_i] [get_bd_pins z20_v15_io_owner/scale_sel_i]
connect_bd_net [get_bd_ports io_owner_alarm_i] [get_bd_pins z20_v15_io_owner/alarm_i]
connect_bd_net [get_bd_ports io_owner_tp_int_i] [get_bd_pins z20_v15_io_owner/tp_int_i]
connect_bd_net [get_bd_pins z20_v15_io_owner/do_o] [get_bd_ports io_owner_do_o]
connect_bd_net [get_bd_pins z20_v15_io_owner/pwm_o] [get_bd_ports io_owner_pwm_o]
connect_bd_net [get_bd_pins z20_v15_io_owner/tp_rst_n_o] [get_bd_ports io_owner_tp_rst_n_o]
connect_bd_net [get_bd_pins z20_v15_io_owner/axis_ena_o] [get_bd_ports axis_ena_o]

# ---- address map ----
assign_bd_address -offset 0x00000000 -range 1G -target_address_space [get_bd_addr_spaces lcd_out/v_frmbuf_rd_0/Data_m_axi_mm_video] [get_bd_addr_segs processing_system7_0/S_AXI_HP0/HP0_DDR_LOWOCM]
assign_bd_address -offset 0x41200000 -range 64K -target_address_space [get_bd_addr_spaces processing_system7_0/Data] [get_bd_addr_segs lcd_out/lcd_id/S_AXI/Reg]
assign_bd_address -offset 0x41210000 -range 64K -target_address_space [get_bd_addr_spaces processing_system7_0/Data] [get_bd_addr_segs axi_gpio_0/S_AXI/Reg]
assign_bd_address -offset 0x41220000 -range 64K -target_address_space [get_bd_addr_spaces processing_system7_0/Data] [get_bd_addr_segs rest_gpio/S_AXI/Reg]
assign_bd_address -offset 0x41620000 -range 64K -target_address_space [get_bd_addr_spaces processing_system7_0/Data] [get_bd_addr_segs i2c4/S_AXI/Reg]
assign_bd_address -offset 0x42C00000 -range 64K -target_address_space [get_bd_addr_spaces processing_system7_0/Data] [get_bd_addr_segs pl_uart/S_AXI/Reg]
assign_bd_address -offset 0x42C10000 -range 64K -target_address_space [get_bd_addr_spaces processing_system7_0/Data] [get_bd_addr_segs rs232/S_AXI/Reg]
assign_bd_address -offset 0x43C00000 -range 64K -target_address_space [get_bd_addr_spaces processing_system7_0/Data] [get_bd_addr_segs lcd_out/lcd_pl_pwm/PWM_AXI/PWM_AXI_reg]
assign_bd_address -offset 0x43C10000 -range 64K -target_address_space [get_bd_addr_spaces processing_system7_0/Data] [get_bd_addr_segs lcd_out/lcd_vtc/ctrl/Reg]
assign_bd_address -offset 0x43C20000 -range 64K -target_address_space [get_bd_addr_spaces processing_system7_0/Data] [get_bd_addr_segs lcd_out/v_frmbuf_rd_0/s_axi_CTRL/Reg]
assign_bd_address -offset 0x43C30000 -range 64K -target_address_space [get_bd_addr_spaces processing_system7_0/Data] [get_bd_addr_segs clk_wiz_0/s_axi_lite/Reg]
assign_bd_address -offset 0x43CB0000 -range 64K -target_address_space [get_bd_addr_spaces processing_system7_0/Data] [get_bd_addr_segs step_ip/s_axi/reg0]

validate_bd_design
save_bd_design
